# Altium schematic sheet Sheet1.SchDoc
size A4; SheetNumber: 1; SheetTotal: 1; ENG_APP_DATE: --/--/--; DSN_APP_DATE: --/--/--; CHK_APP_DATE: --/--/--
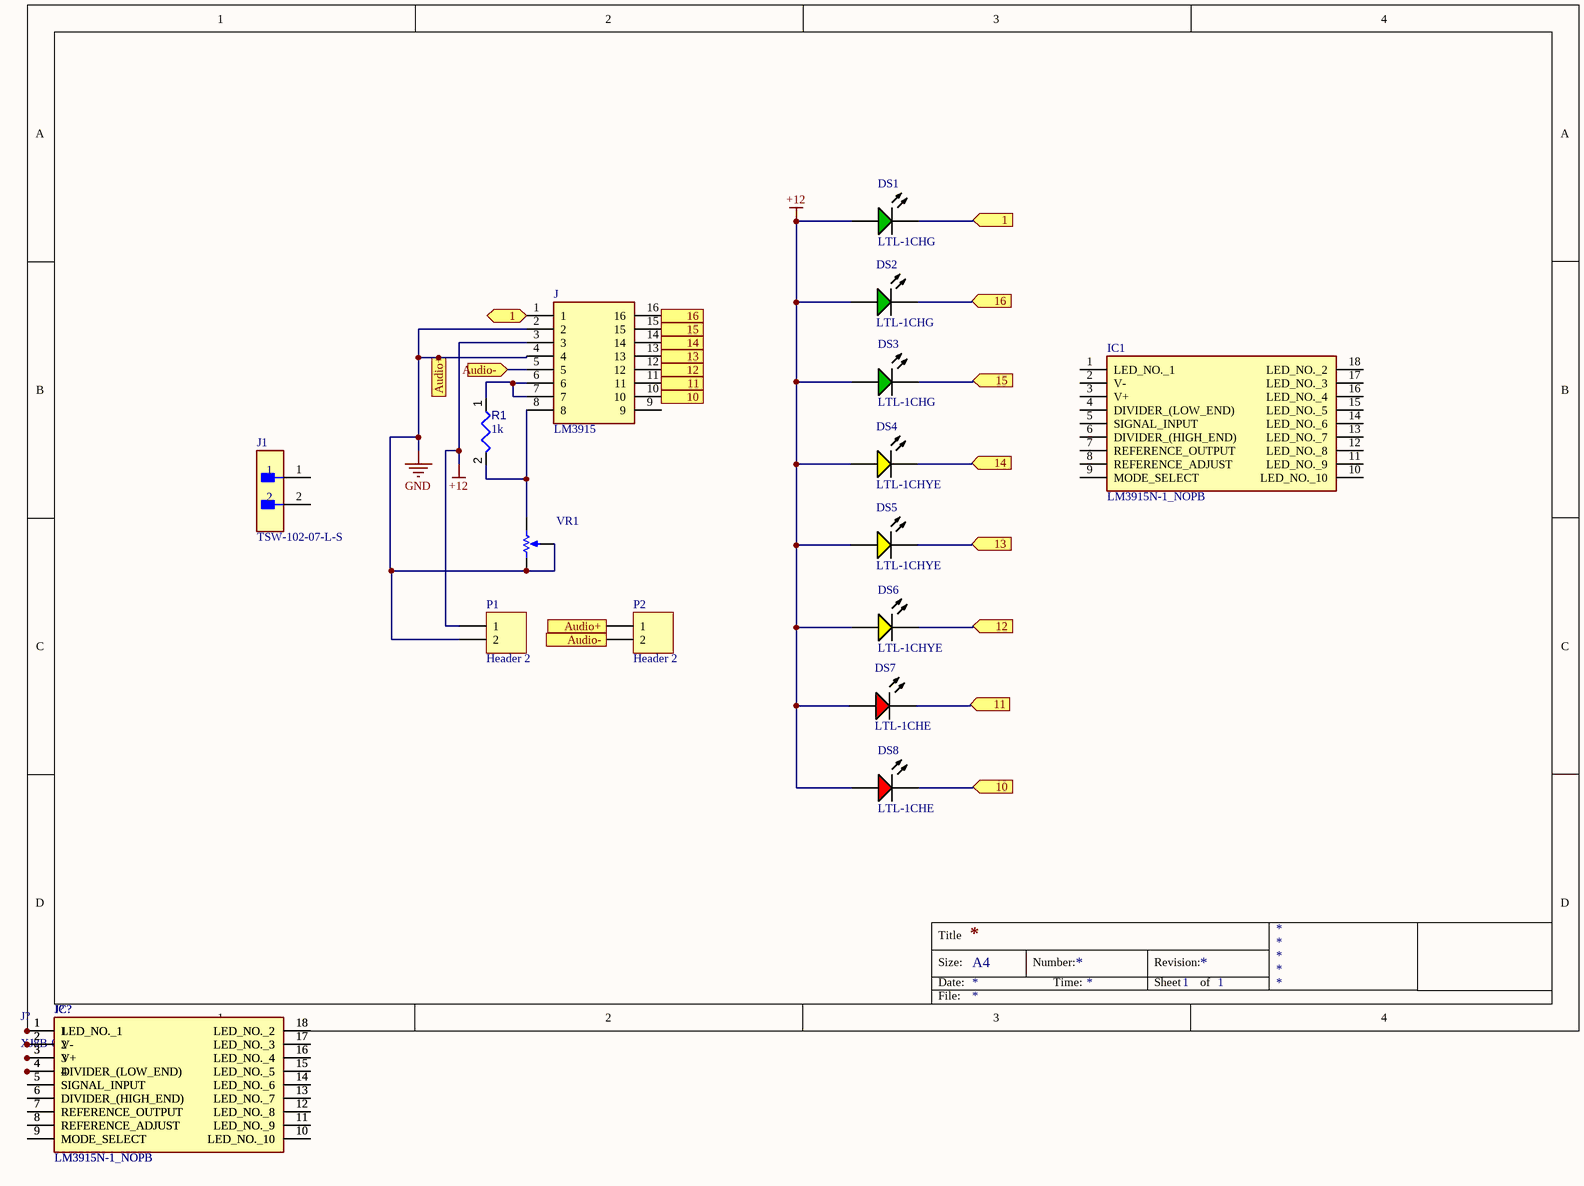
[diagram p0: Sheet1.SchDoc]

## Parts
(Parts that share a designator on the sheet are numbered #1, #2 ... from top to bottom, then left to right.)
DS1  LTL-1CHG  [LTST-LTL-1CHG-2]
DS2  LTL-1CHG  [LTST-LTL-1CHG-2]
DS3  LTL-1CHG  [LTST-LTL-1CHG-2]
DS4  LTL-1CHYE  [LTST-LTL-1CHYE]
DS5  LTL-1CHYE  [LTST-LTL-1CHYE]
DS6  LTL-1CHYE  [LTST-LTL-1CHYE]
DS7  LTL-1CHE  [INDPR60-254-520X380X650]
DS8  LTL-1CHE  [INDPR60-254-520X380X650]
IC1  LM3915N-1_NOPB  [DIP794W56P254L2286H533Q18N]
IC?#1  LM3915N-1_NOPB  [DIP794W56P254L2286H533Q18N]
IC?#2  LM3915N-1_NOPB  [DIP794W56P254L2286H533Q18N]
J  LM3915  [TE_2-1571552-4]
J1  TSW-102-07-L-S  [FP-TSW-102-07-L-S-MFG]
J?#1  XJ8B-0411  [HDRV4W64P0X254_1X4_1020X250X580P]
J?#2  XJ8B-0411  [HDRV4W64P0X254_1X4_1020X250X580P]
P1  Header 2  [HDR1X2]
P2  Header 2  [HDR1X2]
R1  value 1k  [RESA60-630X240]  (hidden comment: MFR-25FBF52-1K)
VR1  3362P-1-103LF  [BOUR-3362P]  (value not drawn)

## Ports
1 (bidir), 1 (in), 10 (in), 10 (out), 11 (in), 11 (out), 12 (in), 12 (out), 13 (in), 13 (out), 14 (in), 14 (out), 15 (in), 15 (out), 16 (in), 16 (out), Audio+ (in), Audio+ (out), Audio- (in), Audio- (out)

## Nets
+12: DS1.1(A) DS2.1(A) DS3.1(A) DS4.1(A) DS5.1(A) DS6.1(A) DS7.1(A) DS8.1(A) J.3 P1.1
GND: J.2 J.4 P1.2 P2.1 VR1.1(CCW) VR1.2(S) ; port Audio+
1: DS1.2(K) J.1 ; port 1
10: DS8.2(K) J.10 ; port 10
11: DS7.2(K) J.11 ; port 11
12: DS6.2(K) J.12 ; port 12
13: DS5.2(K) J.13 ; port 13
14: DS4.2(K) J.14 ; port 14
15: DS3.2(K) J.15 ; port 15
16: DS2.2(K) J.16 ; port 16
Audio-: J.5 P2.2 ; port Audio-
NetIC?#1_1: IC?#1.1(LED_NO._1) IC?#2.1(LED_NO._1) J?#2.1
NetIC?#1_2: IC?#1.2(V-) IC?#2.2(V-) J?#2.2
NetIC?#1_3: IC?#1.3(V+) IC?#2.3(V+) J?#2.3
NetIC?#1_4: IC?#1.4(DIVIDER_(LOW_END)) IC?#2.4(DIVIDER_(LOW_END)) J?#2.4
NetIC?#1_5: IC?#1.5(SIGNAL_INPUT) IC?#2.5(SIGNAL_INPUT)
NetIC?#1_6: IC?#1.6(DIVIDER_(HIGH_END)) IC?#2.6(DIVIDER_(HIGH_END))
NetIC?#1_7: IC?#1.7(REFERENCE_OUTPUT) IC?#2.7(REFERENCE_OUTPUT)
NetIC?#1_8: IC?#1.8(REFERENCE_ADJUST) IC?#2.8(REFERENCE_ADJUST)
NetIC?#1_9: IC?#1.9(MODE_SELECT) IC?#2.9(MODE_SELECT)
NetIC?#1_10: IC?#1.10(LED_NO._10) IC?#2.10(LED_NO._10)
NetIC?#1_11: IC?#1.11(LED_NO._9) IC?#2.11(LED_NO._9)
NetIC?#1_12: IC?#1.12(LED_NO._8) IC?#2.12(LED_NO._8)
NetIC?#1_13: IC?#1.13(LED_NO._7) IC?#2.13(LED_NO._7)
NetIC?#1_14: IC?#1.14(LED_NO._6) IC?#2.14(LED_NO._6)
NetIC?#1_15: IC?#1.15(LED_NO._5) IC?#2.15(LED_NO._5)
NetIC?#1_16: IC?#1.16(LED_NO._4) IC?#2.16(LED_NO._4)
NetIC?#1_17: IC?#1.17(LED_NO._3) IC?#2.17(LED_NO._3)
NetIC?#1_18: IC?#1.18(LED_NO._2) IC?#2.18(LED_NO._2)
NetJ_6: J.6 J.7 R1.1
NetJ_8: J.8 R1.2 VR1.3(CW)

Not connected (* = marked no-connect by the designer): IC1 1(LED_NO._1) 2(V-) 3(V+) 4(DIVIDER_(LOW_END)) 5(SIGNAL_INPUT) 6(DIVIDER_(HIGH_END)) 7(REFERENCE_OUTPUT) 8(REFERENCE_ADJUST) 9(MODE_SELECT) 10(LED_NO._10) 11(LED_NO._9) 12(LED_NO._8) 13(LED_NO._7) 14(LED_NO._6) 15(LED_NO._5) 16(LED_NO._4) 17(LED_NO._3) 18(LED_NO._2); J 9; J1 1 2

## Notes on the sheet
- Title
- Size:
- Date:
- A4
- Number:
- Time:
- Revision:
- Sheet
- of
- File:

## Library data of the parts
DS1-DS3 = CMP-007-00019-2: LED Uni-Color Green, 100 mW, 30 mA, -55 to 100 degC, 2-Pin THD, RoHS, Bulk; Manufacturer: Lite-On; Power: 100mW; Forward Voltage: 2.6V; Forward Current: 30mA; Nominal Vf: 2.1V; Lens Style: Dome; Viewing Angle: 60degrees; Luminous Intensity: 12.6mcd; Max Operating Temperature: 100°C; Case/Package: Radial; Package Reference: LTL-1CHG; Manufacturer URL: http://www.us.liteon.com/; Package Quantity: 1000; Colour: Green; Packaging: Bulk; RoHS Compliant: True; Datasheet URL: http://datasheet.octopart.com/LTL-1CHG-Lite-On-datasheet-143841.pdf; Package Description: 2-Pin Through Hole Device, Dia 3.8 mm; Min Operating Temperature: -55°C; Mounting Technology: TH; Pins: 2; Illumination Colour: Green; Datasheet Version: Mar-00
DS4-DS6 = CMP-007-00020-2: LED Uni-Color Yellow, 60 mW, 20 mA, -55 to 100 degC, 2-Pin THD, RoHS, Bulk; Manufacturer: Lite-On; Nominal Vf: 2.1V; Luminous Intensity: 40mcd; Lens Style: Dome; Forward Current: 20mA; Viewing Angle: 45degrees; Max Operating Temperature: 100°C; Case/Package: Radial; Min Operating Temperature: -55°C; Colour: Yellow; Datasheet Version: Rev. B, 07/2013; Packaging: Bulk; Illumination Colour: Yellow; Package Quantity: 1000; Pins: 2; Package Reference: LTL-1CHYE; Forward Voltage: 2.1V; Mounting Technology: TH; Datasheet URL: https://datasheet.ciiva.com/4269/s-110-ltl-1chye-4269126.pdf; RoHS Compliant: True; Package Description: 2-Pin Through Hole Device, Dia 3.8 mm, Pitch 2.54 mm; Manufacturer URL: http://www.us.liteon.com/
DS7 DS8 = CMP-007-00018-2: LED Uni-Color Red, 100 mW, 30 mA, -55 to 100 degC, 2-Pin THD, RoHS, Bulk; Manufacturer: Lite-On; Forward Current: 20mA; Nominal Vf: 2V; Viewing Angle: 60degrees; Luminous Intensity: 12.6mcd; Lens Style: Dome; Pins: 2; RoHS Compliant: True; Package Reference: LTL-1CHE; Package Quantity: 1000; Mounting Technology: TH; Min Operating Temperature: -55°C; Colour: Red; Case/Package: Radial; Manufacturer URL: http://www.us.liteon.com/; Datasheet URL: https://datasheet.ciiva.com/15117/getdatasheetpartid-187746-15117985.pdf; Forward Voltage: 2V; Max Operating Temperature: 100°C; Illumination Colour: Red; Package Description: 2-Pin Through Hole Device, Dia 3.8 mm, Pitch 2.54 mm; Packaging: Bulk; Datasheet Version: Dec-03
IC1 IC?#1 IC?#2 = LM3915N-1_NOPB: Integrated Circuit; Manufacturer_Name: Texas Instruments; Manufacturer_Part_Number: LM3915N-1/NOPB; Datasheet Link: http://media.digikey.com/pdf/Data%20Sheets/Texas%20Instruments%20PDFs/LM3915.pdf; Height: 5.334mm; Mouser Part Number: 926-LM3915N-1/NOPB; Mouser Price/Stock: https://www.mouser.co.uk/ProductDetail/Texas-Instruments/LM3915N-1-NOPB?qs=QbsRYf82W3Fo14xSwohWxQ%3D%3D
J = 2-1571552-4: 16 (2 x 8) Pos DIP, 0.3 (7.62mm) Row Spacing Socket Gold Through Hole; Contact_Current_Rating_Max: 3 A; MF: TE Connectivity; Package: None; MP: 2-1571552-4; EU_RoHS_Compliance: Compliant with Exemptions; Mouser-Purchase-URL: https://snapeda.com/shop?store=Mouser&id=454027; Price: None; Availability: Warning; Value: *; Product_Type: Socket; SnapEDA_Link: https://www.snapeda.com/parts/2-1571552-4/TE%20Connectivity%20AMP%20Connectors/view-part/454027/?ref=snap
J1 = CMP-02766-001428-1: CONN HEADER VERT 2POS 2.54MM; Voltage Rating: 550V; Current Rating: 7.6A; Gender: Male; Number of Contacts: 2; Connector Type: Male Pin; Radiation Hardening: No; Orientation: Straight; Contact Plating: Gold; Max Operating Temperature: 125°C; Mount: Through Hole; Package Quantity: 1; Number of Rows: 1; Housing Material: Polyester; RoHS Compliant: Yes; Length: 5.08mm; Max Voltage Rating (AC): 550V; Pitch: 2.54mm; Packaging: Bulk; Depth: 2.54mm; Termination: Solder; Min Operating Temperature: -55°C; Housing Color: Black; Lead Free: Lead Free; Color: Black; Number of Positions: 2; Width: 2.54mm; Max Current Rating: 7.6A; REACH SVHC: No SVHC; Contact Material: Bronze; Contact Mating Length: 0.23inch; Series: TSW; Contact Type: Male Pin
J?#1 J?#2 = XJ8B-0411: Connector; Manufacturer_Name: Omron Electronics; Datasheet Link: https://www.omron.com/ecb/products/pdf/en-xj8.pdf; Height: 5.8mm; Manufacturer_Part_Number: XJ8B-0411; Mouser Part Number: 653-XJ8B0411; Mouser Price/Stock: https://www.mouser.co.uk/ProductDetail/Omron-Electronics/XJ8B-0411?qs=8ODJmtm206ec9SYet6om8g%3D%3D
P1 P2 = Header 2: Header, 2-Pin; LatestRevisionDate: 17-Jul-2002; LatestRevisionNote: Re-released for DXP Platform.; Publisher: Altium Limited
R1 = CMP-009-00048-4: Axial Resistor, 1 KOhm, +/- 1%, 250 mW, -55 to 155 degC, 2-Pin THD, RoHS, Bulk; Manufacturer: Yageo; Voltage Rating: 250V; Power: 250mW; Min Operating Temperature: -55°C; Max Operating Temperature: 155°C; Tolerance: 1%; Package Reference: MFR-25; Composition: CarbonFilm; Mounting Technology: TH; Packaging: Bulk; Case/Package: Axial; Datasheet URL: http://www.yageo.com/documents/recent/Yageo%20LR_MFR_2013.pdf; Package Quantity: 200; Manufacturer URL: http://www.yageo.com/; Package Description: 2-Pin Axial Lead, Dia 2.4 mm, Body Length 6.3 mm; Datasheet Version: Apr-13; RoHS Compliant: True
VR1 = CMP-009-00039-2: Square Trimpot(R) Trimming Potentiometer, 10 KOhm, 300 V, -55 to 125 degC, 3-Pin THD, RoHS, Tube; Manufacturer: Bourns; Tolerance: 10%; Power: 500mW; Voltage Rating: 300V; Resistance: 10k; Packaging: Rail/Tube; Package Reference: 3326P; Manufacturer URL: http://www.bourns.com/; Composition: Potentiometer; Package Description: 3-Pin Through Hole Device, Body 6.6 x 6.99 mm, Pitch 2.54 mm; Max Operating Temperature: 125°C; Min Operating Temperature: -55°C; Datasheet Version: May-16; Lead Pitch: 2.54mm; Pins: 3; Datasheet URL: http://www.bourns.com/docs/Product-Datasheets/3362.pdf; Package Quantity: 250; Case/Package: 3326P; RoHS Compliant: True; Mounting Technology: TH